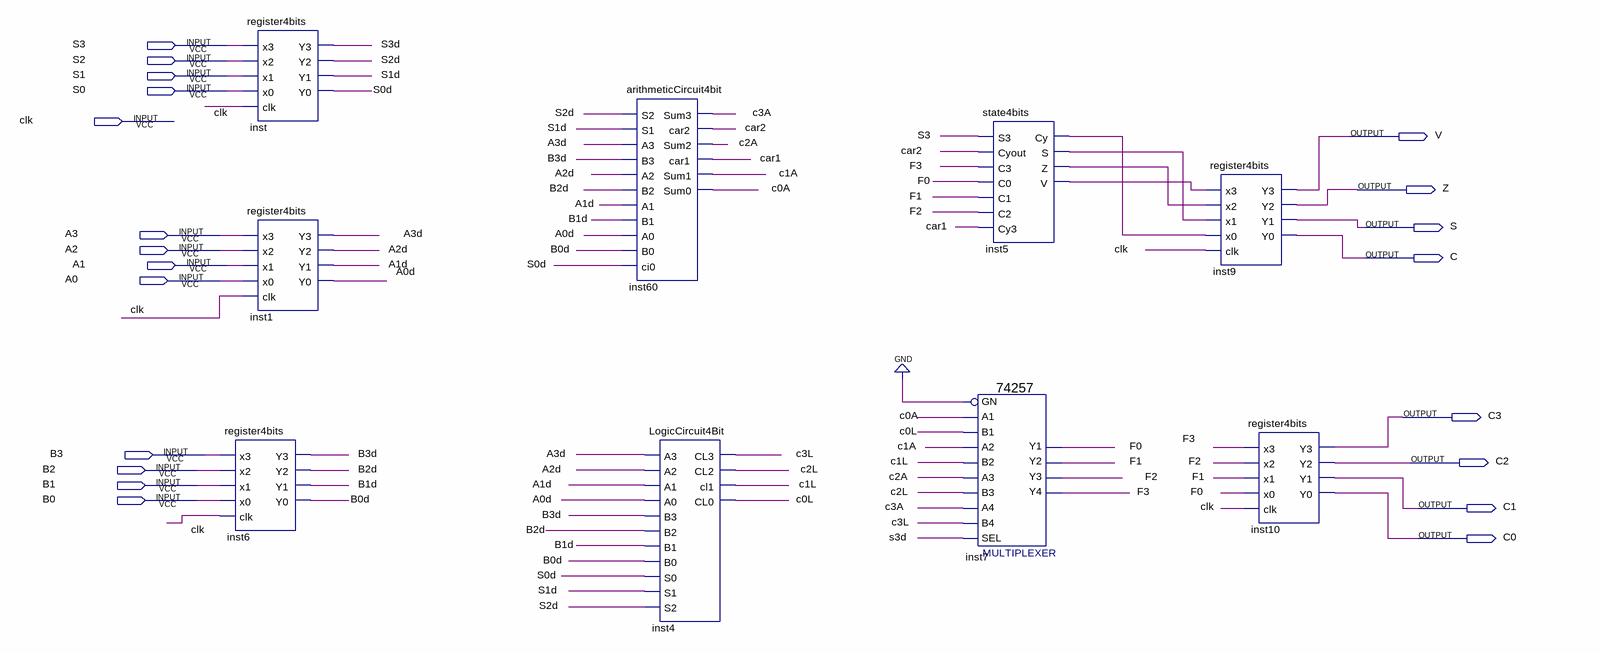
[diagram p0: schematic sheet]
// Quartus schematic Lab3top.bdf as structural Verilog: 9 symbols, 21 pins
module Lab3top (
  input  S3,
  input  S2,
  input  S1,
  input  S0,
  input  clk,
  input  A3,
  input  A2,
  input  A1,
  input  A0,
  input  B3,
  input  B2,
  input  B1,
  input  B0,
  output V,
  output Z,
  output S,
  output C,
  output C3,
  output C2,
  output C1,
  output C0
);

  wire A0d, A1d, A2d, A3d, B0d, B1d, B2d, B3d, c0A, c0L, c1A, c1L, c2A, c2L, c3A, c3L, car1, car2, F0, F1,
       F2, F3, inst5_cy, inst5_s, inst5_v, inst5_z, S0d, S1d, S2d, S3d;

  register4bits inst6 (.x3(B3), .x2(B2), .x1(B1), .x0(B0), .clk(clk), .Y3(B3d), .Y2(B2d), .Y1(B1d), .Y0(B0d));
  register4bits inst (.x3(S3), .x2(S2), .x1(S1), .x0(S0), .clk(clk), .Y3(S3d), .Y2(S2d), .Y1(S1d), .Y0(S0d));
  register4bits inst1 (.x3(A3), .x2(A2), .x1(A1), .x0(A0), .clk(clk), .Y3(A3d), .Y2(A2d), .Y1(A1d), .Y0(A0d));
  arithmeticCircuit4bit inst60 (
    .S2(S2d), .S1(S1d), .A3(A3d), .B3(B3d), .A2(A2d), .B2(B2d), .A1(A1d), .B1(B1d), .A0(A0d), .B0(B0d),
    .ci0(S0d), .Sum3(c3A), .car2(car2), .Sum2(c2A), .car1(car1), .Sum1(c1A), .Sum0(c0A));
  LogicCircuit4Bit inst4 (
    .A3(A3d), .A2(A2d), .A1(A1d), .A0(A0d), .B3(B3d), .B2(B2d), .B1(B1d), .B0(B0d), .S0(S0d), .S1(S1d),
    .S2(S2d), .CL3(c3L), .CL2(c2L), .cl1(c1L), .CL0(c0L));
  \74257  inst7 (
    .B1(c0L), .A1(c0A), .B3(c2L), .A2(c1A), .B2(c1L), .A3(c2A), .A4(c3A), .B4(c3L), .SEL(S3d), .GN(1'b0),
    .Y2(F1), .Y3(F2), .Y4(F3), .Y1(F0));
  state4bits inst5 (
    .S3(S3), .Cyout(car2), .C3(F3), .C0(F0), .C1(F1), .C2(F2), .Cy3(car1), .Cy(inst5_cy), .S(inst5_s),
    .Z(inst5_z), .V(inst5_v));
  register4bits inst9 (
    .x3(inst5_v), .x2(inst5_z), .x1(inst5_s), .x0(inst5_cy), .clk(clk), .Y3(V), .Y2(Z), .Y1(S), .Y0(C));
  register4bits inst10 (.x3(F3), .x2(F2), .x1(F1), .x0(F0), .clk(clk), .Y3(C3), .Y2(C2), .Y1(C1), .Y0(C0));
endmodule
